# EAGLE design RC Receiver (EAGLE 6.5.0)
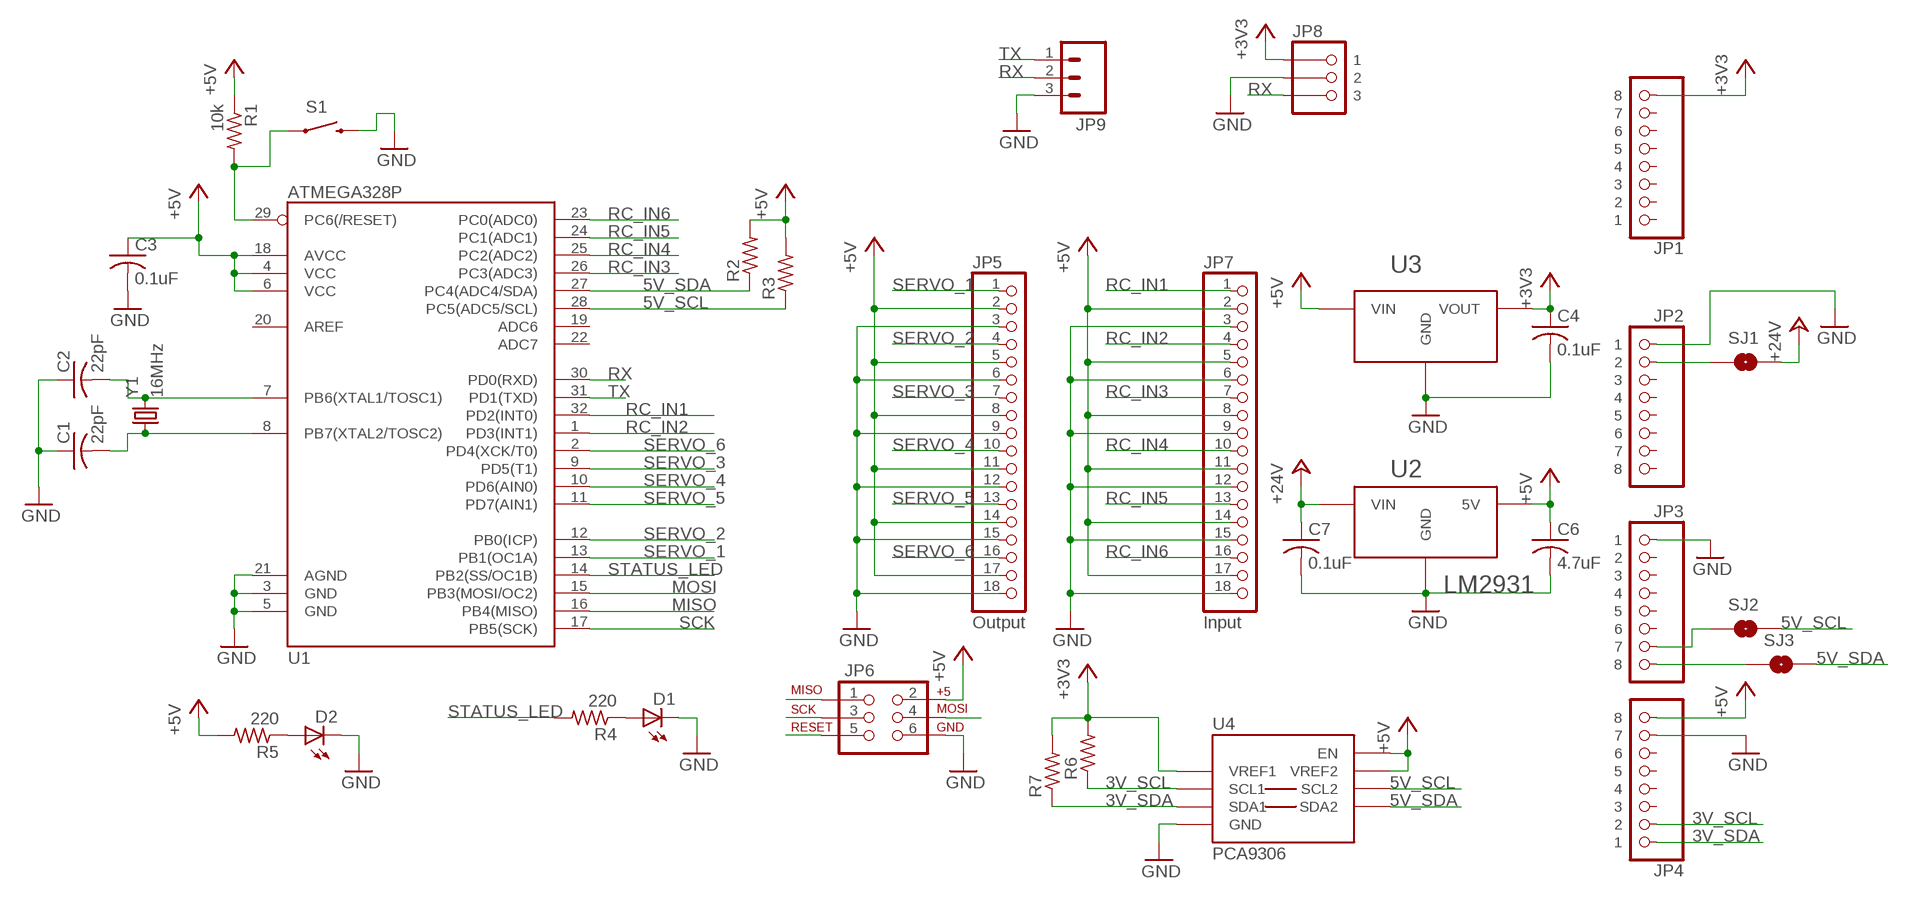
[diagram p0: schematic, sheet 1]

## Parts
C1  22pF  C-USC0603  [C0603]
C2  22pF  C-USC0603  [C0603]
C3  0.1uF  C-USC0603  [C0603]
C4  0.1uF  C-USC0603  [C0603]
C6  4.7uF  C-USC0603  [C0603]
C7  0.1uF  C-USC0603  [C0603]
D1  LED-GREENLED-0805_NO_SILK  [LED-0805]
D2  LED-GREENLED-0805_NO_SILK  [LED-0805]
JP1  8-PIN_HEADER  [8-PIN_RECEPTACLE_LOCK_NO-SS]
JP2  8-PIN_HEADER  [8-PIN_RECEPTACLE_LOCK_NO-SS]
JP3  8-PIN_HEADER  [8-PIN_RECEPTACLE_LOCK_NO-SS]
JP4  8-PIN_HEADER  [8-PIN_RECEPTACLE_LOCK_NO-SS]
JP5  Output  18_PIN_HEADER3X6_PTH_HEADER  [3X6_PTH_HEADER]
JP6  AVR_SPI_PRG_62X3_LOCK  [2X3_LOCK]
JP7  Input  18_PIN_HEADER3X6_PTH_HEADER  [3X6_PTH_HEADER]
JP8  3-PIN_JST_ZH_PTH_CONNECTORRIGHT_ANGLE_PTH  [3-PIN_JST_ZH_CONNECTOR_TH]
JP9  M03LOCK  [1X03_LOCK]
R1  10k  R-US_R0603  [R0603]
R2  R-US_R0603  [R0603]
R3  R-US_R0603  [R0603]
R4  220  R-US_R0603  [R0603]
R5  220  R-US_R0603  [R0603]
R6  R-US_R0603  [R0603]
R7  R-US_R0603  [R0603]
S1  SWITCH-MOMENTARY-2SMD  [TACTILE_SWITCH_SMD]
SJ1  SOLDERJUMPERTRACE  [SJ_2S-TRACE]
SJ2  SOLDERJUMPERNC2  [SJ_2S-NOTRACE]
SJ3  SOLDERJUMPERNC2  [SJ_2S-NOTRACE]
U1  ATMEGA328P  ATMEGA328_SMT  [TQFP32-08]
U2  LM2931  [TO263]
U3  AP7313SOT23R  [SOT23]
U4  PCA9306  [SOIC-8]
Y1  16MHz  CRYSTAL5X3  [CRYSTAL-SMD-5X3]

## Nets
3V_SCL: JP4.P$2 R6.1 U4.P$3(SCL1)
3V_SDA: JP4.P$1 R7.1 U4.P$4(SDA1)
5V_SCL: R3.1 SJ2.2 U1.28(PC5(ADC5/SCL)) U4.P$6(SCL2)
5V_SDA: R2.1 SJ3.2 U1.27(PC4(ADC4/SDA)) U4.P$5(SDA2)
+3V3: C4.1 JP1.P$8 JP8.P$1 R6.2 R7.2 U3.P$2(VOUT) U4.P$2(VREF1)
+5V: C3.1 C6.1 JP4.P$8 JP5.2 JP5.5 JP5.8 JP5.11 JP5.14 JP5.17 JP6.2 JP7.2 JP7.5 JP7.8 JP7.11 JP7.14 JP7.17 R1.1 R2.2 R3.2 R5.2 U1.4(VCC) U1.6(VCC) U1.18(AVCC) U2.P$3(5V) U3.P$3(VIN) U4.P$7(VREF2) U4.P$8(EN)
+24V: C7.1 SJ1.2 U2.P$2(VIN)
GND: C1.1 C2.1 C3.2 C4.2 C6.2 C7.2 D1.2(C) D2.2(C) JP2.P$1 JP3.P$1 JP4.P$7 JP5.3 JP5.6 JP5.9 JP5.12 JP5.15 JP5.18 JP6.6 JP7.3 JP7.6 JP7.9 JP7.12 JP7.15 JP7.18 JP8.P$2 JP9.3 S1.3 U1.3(GND) U1.5(GND) U1.21(AGND) U2.P$1(GND) U3.P$1(GND) U4.P$1(GND)
MISO: JP6.1 U1.16(PB4(MISO))
MOSI: JP6.4 U1.15(PB3(MOSI/OC2))
N$1: C2.2 U1.7(PB6(XTAL1/TOSC1)) Y1.3
N$2: C1.2 U1.8(PB7(XTAL2/TOSC2)) Y1.1
N$4: D2.1(A) R5.1
N$5: JP2.P$2 SJ1.1
N$6: D1.1(A) R4.1
N$7: JP3.P$8 SJ3.1
N$8: JP3.P$7 SJ2.1
RC_IN1: JP7.1 U1.32(PD2(INT0))
RC_IN2: JP7.4 U1.1(PD3(INT1))
RC_IN3: JP7.7 U1.26(PC3(ADC3))
RC_IN4: JP7.10 U1.25(PC2(ADC2))
RC_IN5: JP7.13 U1.24(PC1(ADC1))
RC_IN6: JP7.16 U1.23(PC0(ADC0))
RESET: JP6.5 R1.2 S1.1 U1.29(PC6(/RESET))
RX: JP8.P$3 JP9.2 U1.30(PD0(RXD))
SCK: JP6.3 U1.17(PB5(SCK))
SERVO_1: JP5.1 U1.13(PB1(OC1A))
SERVO_2: JP5.4 U1.12(PB0(ICP))
SERVO_3: JP5.7 U1.9(PD5(T1))
SERVO_4: JP5.10 U1.10(PD6(AIN0))
SERVO_5: JP5.13 U1.11(PD7(AIN1))
SERVO_6: JP5.16 U1.2(PD4(XCK/T0))
STATUS_LED: R4.2 U1.14(PB2(SS/OC1B))
TX: JP9.1 U1.31(PD1(TXD))
Unconnected: JP1.P$1 JP1.P$2 JP1.P$3 JP1.P$4 JP1.P$5 JP1.P$6 JP1.P$7 JP2.P$3 JP2.P$4 JP2.P$5 JP2.P$6 JP2.P$7 JP2.P$8 JP3.P$2 JP3.P$3 JP3.P$4 JP3.P$5 JP3.P$6 JP4.P$3 JP4.P$4 JP4.P$5 JP4.P$6 U1.19(ADC6) U1.20(AREF) U1.22(ADC7)

## Library data of the parts
C1-C4 C6 C7 = resistor:C-US: CAPACITOR, American symbol
D1 D2 = SparkFun-LED:LED-GREEN: Various green LEDs 0603- DIO-00821 LARGE- DIO-00862 LILYPAD- DIO-09910
JP1-JP4 = My Parts:8-PIN_HEADER
JP5 JP7 = My Parts:18_PIN_HEADER
JP6 = SparkFun-Connectors:AVR_SPI_PRG_6: AVR ISP 6 Pin This is the reduced ISP connector for AVR programming. Common on Arduino. This footprint will take up less PCB space and can be used with a 10-pin to 6-pin adapter such as SKU: BOB-08508
JP8 = My Parts:3-PIN_JST_ZH_PTH_CONNECTOR; PART#: 455-1670-ND
JP9 = SparkFun-Connectors:M03: Header 3 Standard 3-pin 0.1" header. Use with straight break away headers (SKU : PRT-00116), right angle break away headers (PRT-00553), swiss pins (PRT-00743), machine pins (PRT-00117), and female headers (PRT-00115). Molex polarized connector foot print use with SKU : PRT-08232 with associated crimp pins and housings.
R1-R7 = resistor:R-US_: RESISTOR, American symbol
S1 = SparkFun-Electromechanical:SWITCH-MOMENTARY-2: Various NO switches- pushbuttons, reed, etc
SJ1-SJ3 = SparkFun-Passives:SOLDERJUMPER: Solder Jumper Standard SMD solder jumper. Used to automate production. Two varients : Normally Open and Normally Closed are the same, but have different paste layers. NC will have a large amount of paste and should jumper during reflow.
U1 = SparkFun-DigitalIC:ATMEGA328_SMT: 32-Pin Atmega328 part Commonly used on Arduino compatible boards Available in QFP and QFN packages TQFP is IC-09069 QFN is non-stock; PROD_ID: IC-09069
U2 = on-semiconductor:LM2931; PART#: lm2931
U3 = My Parts:AP7313: 3.3v LDO Voltage Regulator; PART#: AP7313-33SRG-7
U4 = My Parts:PCA9306
Y1 = SparkFun-FreqCtrl:CRYSTAL: Various standard crystals. Proven footprints. Spark Fun Electronics SKU : COM-00534; PART#: 887-1104-1-ND

## Board
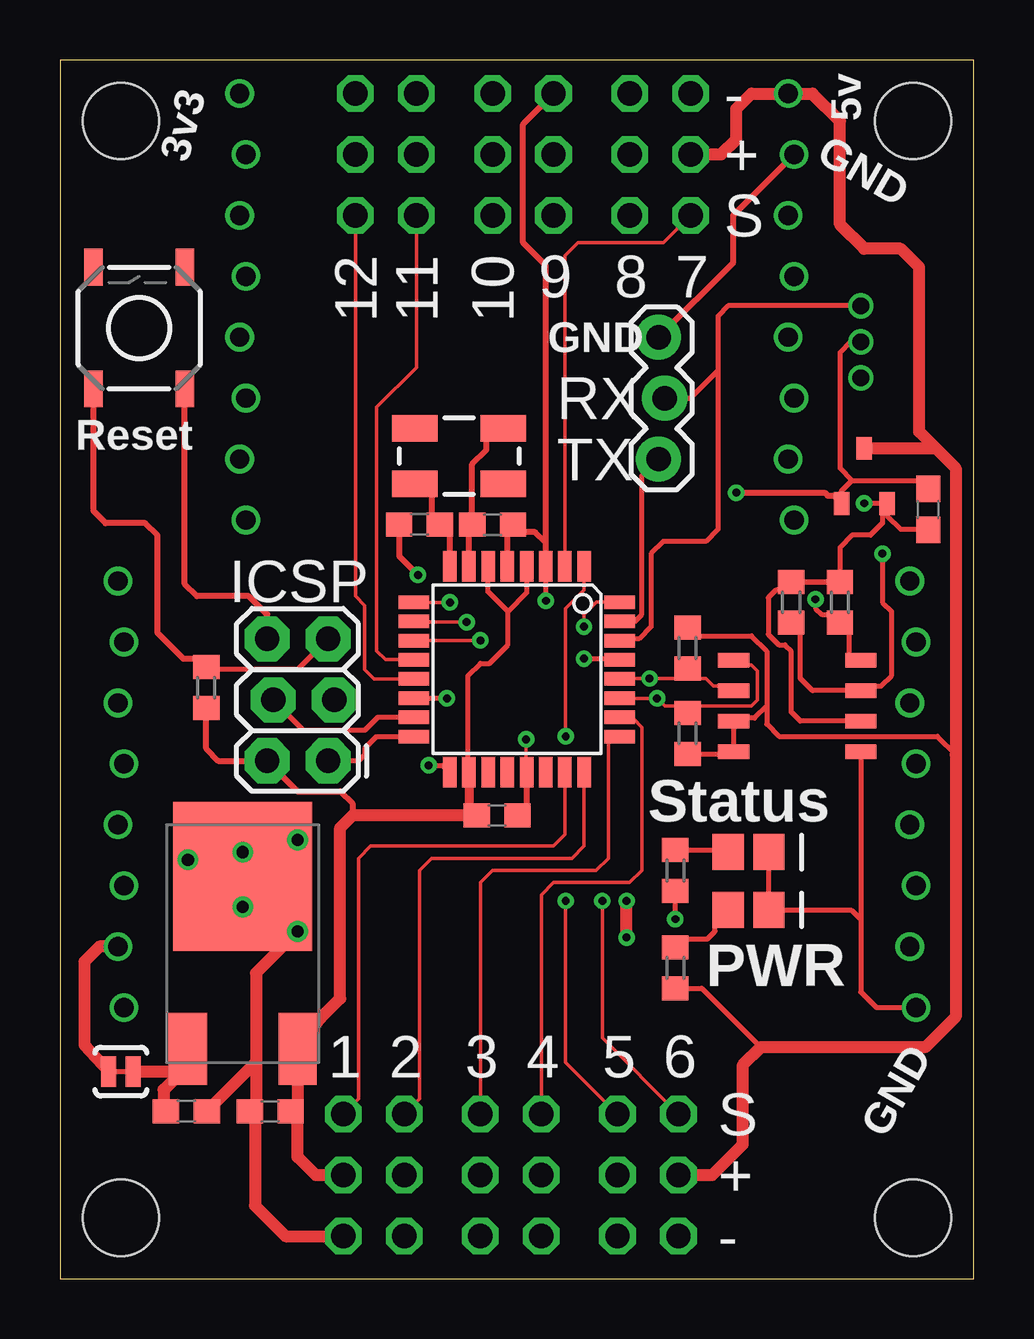
[diagram p1: board, top side]
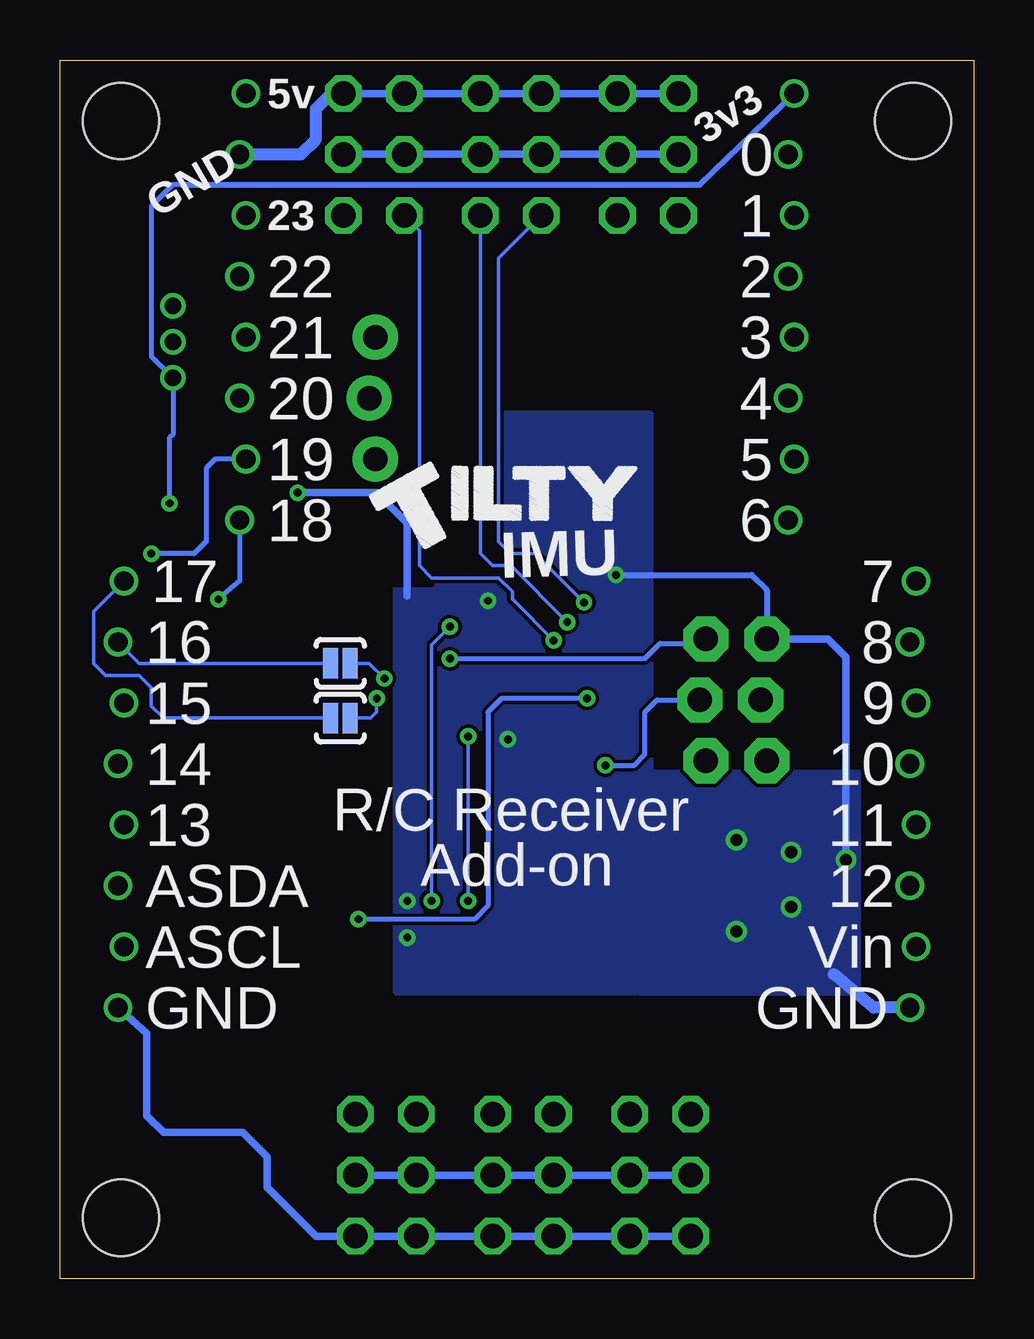
[diagram p2: board, bottom side, seen from below]

Size 38.1 x 50.8 mm. Coordinates in mm from the lower left corner, seen from the top.
Outline: 0,0 38.1,0 38.1,50.8 0,50.8 0,0
Copper layers (1*16): Top 0.0356mm / dielectric 1.5011mm / Bottom 0.0356mm
Design rules "LaenPCBOrder *": minimum track width 6mil, minimum drill 13mil, track to track 6mil, track to pad 6mil, pad to pad 6mil, via to via 6mil, smd to smd 6mil, copper to edge 15mil, drill to drill 6mil, minimum pad ring 7mil, minimum via ring 7mil, stop-mask expansion 4mil, vias tented up to drill 0mil, thermal gap 10mil
Holes 3.17 mm at 2.54,2.54 2.54,48.26 35.56,48.26 35.56,2.54

### Footprints (pad centres in the part's own frame; a part is rotated, then mirrored left to right if it is on the bottom)
C0603 = smd 1.1 x 1: 1 -0.85,0; 2 0.85,0
LED-0805 = smd 1.3 x 1.5: 1 -0.85,0; 2 0.85,0
8-PIN_RECEPTACLE_LOCK_NO-SS = drill 0.8: P$1 -8.89,-0.127; P$2 -6.35,0.127; P$3 -3.81,-0.127; P$4 -1.27,0.127; P$5 1.27,-0.127; P$6 3.81,0.127; P$7 6.35,-0.127; P$8 8.89,0.127
3X6_PTH_HEADER = drill 1.016 octagon: 1 -6.985,-2.54; 2 -6.985,0; 3 -6.985,2.54; 4 -4.445,-2.54; 5 -4.445,0; 6 -4.445,2.54; 7 -1.27,-2.54; 8 -1.27,0; 9 -1.27,2.54; 10 1.27,-2.54; 11 1.27,0; 12 1.27,2.54; 13 4.445,-2.54; 14 4.445,0; 15 4.445,2.54; 16 6.985,-2.54; 17 6.985,0; 18 6.985,2.54
2X3_LOCK = drill 1.016 pad 1.88 octagon: 1 0,0; 2 0,2.54; 3 2.54,-0.254; 4 2.54,2.286; 5 5.08,0; 6 5.08,2.54
3-PIN_JST_ZH_CONNECTOR_TH = drill 0.7: P$1 -1.5,1.6; P$2 0,1.6; P$3 1.5,1.6
1X03_LOCK = drill 1.016 pad 1.88: 1 0,0.127; 2 2.54,-0.127; 3 5.08,0.127
R0603 = smd 1 x 1.1: 1 -0.85,0; 2 0.85,0
TACTILE_SWITCH_SMD = smd 1.524 x 0.762: 1 -2.54,1.905; 2 2.54,1.905; 3 -2.54,-1.905; 4 2.54,-1.905
SJ_2S-TRACE = smd 0.635 x 1.27: 1 -0.508,0; 2 0.508,0
SJ_2S-NOTRACE = smd 0.635 x 1.27: 1 -0.401,0; 2 0.413,0
TQFP32-08 = smd 1.27 x 0.559: 1 -4.293,2.8; 2 -4.293,2; 3 -4.293,1.2; 4 -4.293,0.4; 5 -4.293,-0.4; 6 -4.293,-1.2; 7 -4.293,-2; 8 -4.293,-2.8; 17 4.293,-2.8; 18 4.293,-2; 19 4.293,-1.2; 20 4.293,-0.4; 21 4.293,0.4; 22 4.293,1.2; 23 4.293,2; 24 4.293,2.8 | smd 0.559 x 1.27: 9 -2.8,-4.293; 10 -2,-4.293; 11 -1.2,-4.293; 12 -0.4,-4.293; 13 0.4,-4.293; 14 1.2,-4.293; 15 2,-4.293; 16 2.8,-4.293; 25 2.8,4.293; 26 2,4.293; 27 1.2,4.293; 28 0.4,4.293; 29 -0.4,4.293; 30 -1.2,4.293; 31 -2,4.293; 32 -2.8,4.293
TO263 = smd 5.791 x 6.198: P$1 0,2.794 | smd 1.6 x 2.997: P$2 -2.286,-4.394; P$3 2.286,-4.394
SOT23 = smd 0.65 x 0.95: P$1 -0.95,-1.15; P$2 0.95,-1.15; P$3 0,1.15
SOIC-8 = smd 1.3 x 0.6: P$1 -2.65,1.905; P$2 -2.65,0.635; P$3 -2.65,-0.635; P$4 -2.65,-1.905; P$5 2.65,-1.905; P$6 2.65,-0.635; P$7 2.65,0.635; P$8 2.65,1.905
CRYSTAL-SMD-5X3 = smd 1.9 x 1.1: 1 -1.85,-1.15; 2 1.85,-1.15; 3 1.85,1.15; 4 -1.85,1.15

### Placement (x,y rotation side)
C1  14.99,31.43 0 top
C2  18.03,31.43 180 top
C3  18.22,19.3 0 top
C4  36.2,32.07 90 top
C6  8.76,6.99 180 top
C7  5.27,6.99 0 top
D1  28.7,17.78 0 top
D2  28.7,15.37 0 top
JP1  7.62,40.51 90 top
JP2  2.54,20.19 90 top
JP3  35.56,20.19 90 top
JP4  30.48,40.51 90 top
JP5  19.3,46.86 0 top
JP6  11.18,21.59 90 top
JP7  18.8,4.32 180 top
JP8  34.99,39.05 90 top
JP9  25.08,34.16 90 top
R1  6.1,24.64 90 top
R2  26.16,22.73 270 top
R3  26.16,26.29 90 top
R4  25.65,17.02 270 top
R5  25.65,12.95 270 top
R6  30.48,28.19 90 top
R7  32.51,28.19 90 top
S1  3.3,39.62 90 top
SJ1  2.54,8.64 0 top
SJ2  26.42,25.65 0 bottom
SJ3  26.42,23.37 0 bottom
U1  19.05,25.4 270 top
U2  7.62,13.97 0 top
U3  33.53,33.46 0 top
U4  30.73,23.88 180 top
Y1  16.64,34.29 0 top

### Tracks (layer width: path | path; a pad name or v marks a point on that pad's centre or on a via)
3V_SCL  (via drill 0.33)
  Top 0.203: R6.1 30.86,27.22 30.86,25.02 31.37,24.51 U4.P$3 33.72,24.51 33.91,24.7 34.23,24.7 34.67,25.15 34.67,27.81 34.29,28.19 v34.29,30.23
  Bottom 0.203: JP4.P$2 31.62,34.16 32,33.78 32,30.73 32.51,30.23 v34.29,30.23
3V_SDA  (via drill 0.33)
  Top 0.203: R7.1 32.51,27.56 32.83,27.24 | 32.83,27.24 32.89,27.24 32.89,25.91 33.26,25.91 U4.P$4 | 32.7,27.24 32.83,27.24 | 32.61,27.24 R7.1 | v31.5,28.32 31.5,27.94 31.75,27.69 32.17,27.69 R7.1
  Bottom 0.203: JP4.P$1 30.61,29.08 v31.5,28.32
5V_SCL  (via drill 0.33)
  Top 0.152: U4.P$6 27.89,24.7 27.24,24.7 26.92,25.02 26.67,25.02 26.25,25.44 R3.1 25.74,25.02 v24.57,25.02 23.34,25.02 U1.28
  Bottom 0.152: SJ2.2 25.21,25.65 v24.57,25.02
5V_SDA  (via drill 0.33)
  Top 0.152: U4.P$5 28.27,25.59 28.83,25.59 29.08,25.34 29.08,24.13 28.83,23.88 26.61,23.88 26.31,23.58 R2.1 25.87,23.88 25.21,23.88 v24.89,24.19 U1.27
  Bottom 0.152: SJ3.2 25.15,23.37 24.89,23.62 v24.89,24.19
+3V3  (via drill 0.33)
  Top 0.203: 34.48,31.82 U3.P$2 34.47,32.32 v33.53,32.32 | 34.48,31.82 35.05,31.24 36.17,31.24 C4.1 | 34.48,31.82 34.29,32 34.29,31.5 33.78,30.99 33.02,30.99 32.51,30.48 R7.2 | R6.2 30.99,29.04 | 30.99,29.04 R7.2 | 30.82,29.21 30.99,29.04 | R7.2 30.57,29.04 30.48,28.96 30.23,28.96 29.97,28.7 29.84,28.7 29.53,28.38 29.53,26.86 29.97,26.42 30.23,26.42 30.48,26.16 30.48,23.62 30.86,23.24 U4.P$2
  Bottom 0.203: v33.53,32.32 33.53,35.05 33.39,35.19 JP8.P$1 34.29,38.45 34.29,44.7 33.4,45.59 33.02,45.59
  Bottom 0.254: 33.02,45.59 11.43,45.59 JP1.P$8
+5V
  Top 0.203: 17.02,21.14 17.02,25.15 17.53,25.65 17.91,25.65 18.67,26.42 18.67,27.81 | R2.2 28,21.88 U4.P$8 U4.P$7 28.21,23.37 28.96,23.37 29.46,23.88 | 26.67,26.8 26.54,26.8 26.2,27.14 R3.2 26.33,27.14 26.67,26.8 | 26.67,26.8 28.83,26.8 29.46,26.16 29.46,23.88 | 29.46,23.88 29.46,23.11 29.97,22.61 36.58,22.61 37.34,21.84 | R5.2 26.76,12.1 29.21,9.65 | 18.67,27.81 17.84,28.64 U1.6 | U1.4 19.45,28.59 18.67,27.81
  Top 0.254: 17.02,21.14 U1.18 | 17.05,19.69 C3.1 | R1.1 6.1,22.1 6.6,21.59 JP6.2 9.91,20.32 11.68,20.32 12.19,19.81 12.19,19.3
  Top 0.381: U1.18 17.05,19.69
  Top 0.508: C3.1 12.19,19.3 11.68,18.8 11.68,11.68 10.85,10.85 U2.P$3 9.91,7.2 C6.1 9.91,6.95 9.91,5.08 10.67,4.32 JP7.17 | JP7.2 27.18,4.32 28.45,5.59 28.45,8.89 29.21,9.65 36.07,9.65 37.34,10.92 37.34,21.84 37.34,33.78 36.51,34.61 | JP5.17 27.56,46.86 28.19,47.5 28.19,48.77 28.83,49.4 JP4.P$8 31.37,49.4 32.51,48.26 32.51,43.94 33.53,42.93 35.05,42.93 35.81,42.16 35.81,35.31 36.51,34.61 | U3.P$3 36.51,34.61
  Bottom 0.318: JP7.2 JP7.5 JP7.8 JP7.11 JP7.14 JP7.17 | JP5.2 JP5.5 JP5.8 JP5.11 JP5.14 JP5.17
+24V
  Top 0.508: SJ1.2 5.08,8.64 | U2.P$2 5.29,10.81 5.29,8.64 5.08,8.64 | 5.08,8.64 4.32,7.87 4.32,7.09 C7.1
GND  (via drill 0.33, 0.51)
  Top 0.152: v19.43,22.48 19.43,21.13 U1.21
  Top 0.203: U3.P$1 32.58,32.83 33.02,33.27 | 33.02,33.27 35.84,33.27 C4.2 | JP8.P$2 32.96,39.05 32.51,38.61 32.51,33.78 33.02,33.27 | U4.P$1 33.38,14.97 | v20.26,28.26 U1.3 | D1.2 D2.2 32.99,15.37 33.38,14.97 | 33.38,14.97 33.38,11.96 34.04,11.3 JP3.P$1
  Top 0.254: U1.5 18.65,31.2 C2.1 19.2,31.11 19.81,31.11 20.25,30.68 | U1.3 20.25,30.68 | U1.21 19.45,19.62 C3.2 | S1.3 5.21,28.96 5.71,28.45 7.87,28.45 8.64,27.69 JP6.6 | 20.25,30.68 20.25,42.23 19.3,43.18 19.3,48.13 JP5.12 | C1.1 14.14,30.12 v14.92,29.34 | v28.19,32.77 31.88,32.77 32,32.64 32.25,32.64 U3.P$1 | JP4.P$7 28.07,44.32 28.07,42.35 JP9.3
  Top 0.508: v9.91,14.48 8.17,12.74 8.17,9.03 | 8.17,9.03 C7.2 | 8.17,9.03 8.17,7.24 C6.2 8.13,6.95 8.13,3.05 9.4,1.78 JP7.18 | v23.62,14.22 v23.62,15.75 | U2.P$1 v7.62,17.78
  Bottom 0.254: v14.92,29.34 9.27,29.34 8.64,28.7 JP6.6
  Bottom 0.305: JP3.P$1 34.48,10.22 34.48,6.79 33.78,6.1 30.48,6.1 29.46,5.08 29.46,3.81 27.43,1.78 JP7.3
  Bottom 0.318: JP7.18 JP7.15 JP7.12 JP7.9 JP7.6 JP7.3 | JP5.3 JP5.6 JP5.9 JP5.12 JP5.15 JP5.18 | v28.19,32.77 24.89,32.77 23.62,31.5 23.62,28.45 | v5.33,17.46 5.33,25.91 6.1,26.67 JP6.6
  Bottom 0.508: JP5.18 26.8,49.4 27.43,48.77 27.43,47.5 28.07,46.86 JP4.P$7 | JP2.P$1 4.19,11.3 5.84,12.7
  other vias: 9.91,18.29 7.62,15.49
  pour Bottom: 13.46,36.07 24.13,36.07 24.13,11.94 13.46,11.94
  pour Bottom: 13.97,11.94 4.83,11.94 4.83,21.08 13.97,21.08
MISO
  Top 0.203: JP6.1 12.45,21.59 12.7,21.84 12.7,22.1 13.2,22.6 U1.16
MOSI
  Top 0.203: U1.15 13.24,23.4 12.7,22.86 10.16,22.86 JP6.4
N$1
  Top 0.254: U1.7 17.05,31.3 C2.2 17.18,33.95 17.78,34.54 17.78,35.31 18.35,35.31 Y1.3
N$2
  Top 0.254: U1.8 16.25,31.02 C1.2 15.49,31.77 15.49,32.77 15.12,33.14 Y1.1
N$3
  cutout Bottom: 22.61,36.58 25.65,36.58 25.65,36.32 25.65,28.96 22.61,28.96
N$4
  Top 0.203: R5.1 25.8,13.8 26.16,14.16 26.99,14.16 27.3,14.48 27.3,14.82 D2.1
N$5
  Top 0.508: JP2.P$2 1.65,13.84 1.02,13.21 1.02,9.75 SJ1.1
N$6
  Top 0.203: R4.1 27.76,17.87 D1.1
N$7
  Bottom 0.152: SJ3.1 33.78,23.37 34.29,23.88 34.29,24.64 34.8,25.15 36.2,25.15 36.7,25.65 36.7,27.81 JP3.P$8
N$8
  Bottom 0.152: SJ2.1 34.8,25.65 JP3.P$7
RC_IN1  (via drill 0.33)
  Top 0.152: U1.32 22.36,28.2 21.84,27.69 v21.84,27.18 | v22.61,15.75 22.61,10.03 JP7.1
  Bottom 0.152: v21.84,27.18 22.61,26.42 v22.61,15.75
RC_IN2  (via drill 0.33)
  Top 0.152: U1.1 21.85,28.71 21.08,27.94 v21.08,22.61 | v21.08,15.75 21.08,9.02 JP7.4
  Bottom 0.152: v21.08,22.61 v21.08,15.75
RC_IN3
  Top 0.152: JP7.7 20.07,16 20.57,16.51 23.75,16.51 24.26,17.02 24.26,22.99 23.88,23.37 23.38,23.37 U1.26
RC_IN4
  Top 0.152: JP7.10 17.53,16.51 18.03,17.02 22.35,17.02 22.86,17.53 22.86,22.42 23.16,22.42 U1.25
RC_IN5
  Top 0.152: U1.24 21.85,18.04 21.34,17.53 15.49,17.53 14.99,17.02 14.99,7.49 JP7.13
RC_IN6
  Top 0.152: U1.23 21.05,18.51 20.57,18.03 12.95,18.03 12.45,17.53 12.45,7.49 JP7.16
RESET  (via drill 0.33)
  Top 0.203: v21.84,25.84 23.3,25.84 U1.29 | JP6.5 9.91,25.4 6.18,25.4 R1.2
  Top 0.254: S1.1 1.4,32 1.91,31.5 3.56,31.5 4.06,30.99 4.06,26.92 5.14,25.84 5.74,25.84 R1.2
  Bottom 0.203: v21.84,25.84 13.72,25.84 13.08,26.48 11.37,26.48 JP6.5
RX
  Top 0.203: JP8.P$3 27.85,40.55 27.43,40.13 27.43,37.85 | 27.43,37.85 27.43,31.24 26.92,30.73 25.15,30.73 24.64,30.23 24.64,27.18 24.13,26.67 23.41,26.67 U1.30 | JP9.2 26.29,36.7 27.43,37.85
SCK  (via drill 0.33)
  Top 0.203: 16.26,21.34 16.21,21.29 16.25,21.25 U1.17 15.96,21.4 v15.37,21.4
  Bottom 0.203: JP6.3 13.21,24.13 13.72,23.62 13.72,21.84 14.16,21.4 v15.37,21.4
SERVO_1
  Top 0.152: U1.13 13.1,25 12.7,25.4 12.7,28.07 12.32,28.45 JP5.1
SERVO_2
  Top 0.152: U1.12 13.57,25.8 13.21,26.16 13.21,36.32 14.86,37.97 JP5.4
SERVO_3  (via drill 0.33)
  Top 0.152: U1.9 v16.26,28.19
  Top 0.254: U1.9
  Bottom 0.152: v16.26,28.19 18.29,30.23 19.3,30.23 19.81,30.73 19.81,42.55 JP5.7
SERVO_4  (via drill 0.33)
  Top 0.152: 14.79,27.37 v16.95,27.37
  Top 0.254: 14.79,27.37 U1.10
  Bottom 0.152: v16.95,27.37 19.3,29.72 20.07,29.72 20.57,30.23 JP5.10
SERVO_5  (via drill 0.33)
  Top 0.152: U1.11 v17.53,26.61
  Top 0.254: U1.11
  Bottom 0.152: v17.53,26.61 19.24,28.32 19.24,28.64 19.81,29.21 22.61,29.21 23.11,29.72 23.11,43.69 JP5.13
SERVO_6
  Top 0.152: U1.2 21.05,42.64 21.59,43.18 25.15,43.18 JP5.16
STATUS_LED  (via drill 0.33)
  Top 0.203: v16.13,24.19 U1.14 | v25.65,14.99 R4.2
  Bottom 0.203: v16.13,24.19 19.68,24.19 20.26,23.62 20.26,15.56 20.83,14.99 v25.65,14.99
TX
  Top 0.203: U1.31 23.97,27.4 24.26,27.69 24.26,33.47 JP9.1

### Text on the board
tNames: - | 5v | 3v3 | + | GND | S | 9 | 8 | 7 | 12 | 11 | 10 | GND | RX | Reset | TX | ICSP | Status | PWR | GND | 1 | 2 | 3 | 4 | 5 | 6 | S | + | -
bNames: 5v | 3v3 | 0 | 23 | GND | 1 | 2 | 22 | 3 | 21 | 4 | 20 | 5 | 19 | 6 | 18 | IMU | 7 | 17 | 8 | 16 | 9 | 15 | 10 | 14 | R/C Receiver | 11 | 13 | Add-on | 12 | ASDA | Vin | ASCL | GND | GND